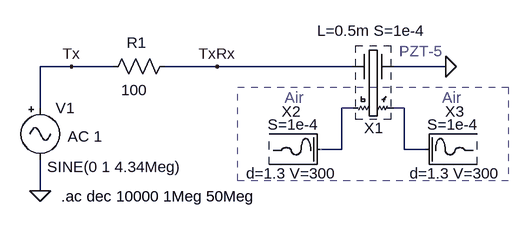
[diagram p0: schematic TestRezonatorAir.asc]
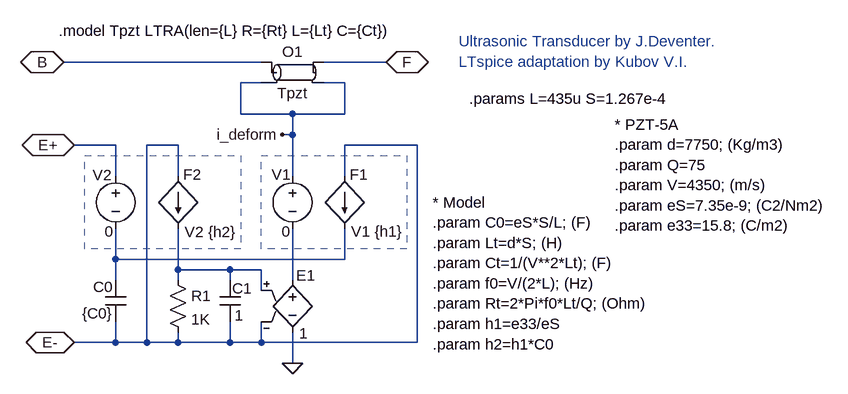
[diagram p1: sub-circuit piezoelement.asc]
TestRezonatorAir.asc, the LTspice schematic file:
Version 4
SHEET 1 880 680
WIRE -80 112 -128 112
WIRE -16 112 -80 112
WIRE 144 112 64 112
WIRE 352 112 144 112
WIRE 496 112 416 112
WIRE -128 176 -128 112
WIRE 352 176 336 176
WIRE 432 176 416 176
WIRE 336 240 336 176
WIRE 336 240 304 240
WIRE 432 240 432 176
WIRE 464 240 432 240
WIRE -128 304 -128 256
FLAG 496 112 0
FLAG -128 304 0
FLAG -80 112 Tx
FLAG 144 112 TxRx
SYMBOL PiezoElement 384 144 R0
WINDOW 0 1 63 Center 0
WINDOW 3 -2 -87 Center 0
SYMATTR InstName X1
SYMATTR Value L=0.5m S=1e-4
SYMBOL SubstInf 256 240 M0
WINDOW 0 -2 -59 Center 0
SYMATTR InstName X2
SYMATTR Value2 d=1.3 V=300
SYMBOL Misc\\signal -128 160 R0
WINDOW 3 11 107 Left 0
WINDOW 123 42 60 Left 0
WINDOW 39 0 0 Left 0
SYMATTR Value SINE(0 1 4.34Meg)
SYMATTR Value2 AC 1
SYMATTR InstName V1
SYMBOL res 80 96 R90
WINDOW 0 -5 60 VBottom 0
WINDOW 3 37 63 VTop 0
SYMATTR InstName R1
SYMATTR Value 100
SYMBOL SubstInf 512 240 R0
WINDOW 0 -2 -59 Center 0
SYMATTR InstName X3
SYMATTR Value2 d=1.3 V=300
TEXT 248 160 Left 0 ;Air
TEXT -96 312 Left 0 !.ac dec 10000 1Meg 50Meg
TEXT 424 88 Left 0 ;PZT-5
TEXT 520 160 Right 0 ;Air
RECTANGLE Normal 592 288 176 144 2

piezoelement.asc, the sub-circuit schematic file:
Version 4
SHEET 1 1424 680
WIRE 352 -96 48 -96
WIRE 544 -96 448 -96
WIRE 352 -64 320 -64
WIRE 480 -64 448 -64
WIRE 320 -16 320 -64
WIRE 400 -16 320 -16
WIRE 480 -16 480 -64
WIRE 480 -16 400 -16
WIRE 400 16 400 -16
WIRE 400 16 384 16
WIRE 128 32 64 32
WIRE 224 32 176 32
WIRE 592 32 480 32
WIRE 128 80 128 32
WIRE 224 80 224 32
WIRE 400 80 400 16
WIRE 480 80 480 32
WIRE 128 208 128 160
WIRE 480 208 480 160
WIRE 480 208 128 208
WIRE 224 224 224 160
WIRE 304 224 224 224
WIRE 352 224 304 224
WIRE 128 240 128 208
WIRE 224 240 224 224
WIRE 304 240 304 224
WIRE 400 240 400 160
WIRE 352 256 352 224
WIRE 128 336 128 304
WIRE 128 336 64 336
WIRE 176 336 176 32
WIRE 176 336 128 336
WIRE 224 336 224 320
WIRE 224 336 176 336
WIRE 304 336 304 304
WIRE 304 336 224 336
WIRE 352 336 352 304
WIRE 352 336 304 336
WIRE 592 336 592 32
WIRE 592 336 352 336
WIRE 400 368 400 320
FLAG 48 -96 B
IOPIN 48 -96 BiDir
FLAG 544 -96 F
IOPIN 544 -96 BiDir
FLAG 64 32 E+
IOPIN 64 32 BiDir
FLAG 64 336 E-
IOPIN 64 336 BiDir
FLAG 384 16 i_deform
FLAG 400 368 0
SYMBOL e 400 224 R0
WINDOW 0 6 9 Left 0
WINDOW 3 10 98 Left 0
SYMATTR InstName E1
SYMATTR Value 1
SYMBOL cap 112 240 R0
WINDOW 0 12 10 Right 0
WINDOW 3 12 51 Right 0
SYMATTR InstName C0
SYMATTR Value {C0}
SYMBOL res 208 224 R0
SYMATTR InstName R1
SYMATTR Value 1K
SYMBOL cap 288 240 R0
WINDOW 0 19 13 Left 0
WINDOW 3 23 54 Left 0
SYMATTR InstName C1
SYMATTR Value 1
SYMBOL ltline 400 -80 R0
SYMATTR InstName O1
SYMATTR Value Tpzt
SYMBOL f 224 80 R0
WINDOW 0 8 -3 Left 0
WINDOW 3 10 86 Left 0
SYMATTR InstName F2
SYMATTR Value V2 {h2}
SYMBOL voltage 128 64 R0
WINDOW 0 -6 14 Right 0
WINDOW 3 -3 101 Right 0
WINDOW 123 0 0 Left 0
WINDOW 39 0 0 Left 0
SYMATTR InstName V2
SYMATTR Value 0
SYMBOL voltage 400 64 R0
WINDOW 0 -3 13 Right 0
WINDOW 3 -3 101 Right 0
WINDOW 123 0 0 Left 0
WINDOW 39 0 0 Left 0
SYMATTR InstName V1
SYMATTR Value 0
SYMBOL f 480 80 R0
WINDOW 0 8 -3 Left 0
WINDOW 3 10 85 Left 0
SYMATTR InstName F1
SYMATTR Value V1 {h1}
TEXT 40 -144 Left 0 !.model Tpzt LTRA(len={L} R={Rt} L={Lt} C={Ct})
TEXT 896 0 Left 0 !* PZT-5A\n.param d=7750; (Kg/m3)\n.param Q=75\n.param V=4350; (m/s)\n.param eS=7.35e-9; (C2/Nm2)\n.param e33=15.8; (C/m2)
TEXT 656 -128 Left 0 ;Ultrasonic Transducer by J.Deventer. \nLTspice adaptation by Kubov V.I.
TEXT 616 120 Left 0 !* Model\n.param C0=eS*S/L; (F)\n.param Lt=d*S; (H) \n.param Ct=1/(V**2*Lt); (F)\n.param f0=V/(2*L); (Hz)\n.param Rt=2*Pi*f0*Lt/Q; (Ohm)\n.param h1=e33/eS \n.param h2=h1*C0
TEXT 672 -40 Left 0 !.params L=435u S=1.267e-4
RECTANGLE Normal 320 192 80 48 2
RECTANGLE Normal 576 192 352 48 2

The netlist it stands for:
* TestRezonatorAir.asc
XX1 TxRx 0 N001 N002 piezoelement params: L=0.5m S=1e-4
XX2 N001 SubstInf params: S=1e-4 d=1.3 V=300  ; pins b
V1 Tx 0 SINE(0 1 4.34Meg) AC 1
R1 TxRx Tx 100
XX3 N002 SubstInf params: S=1e-4 d=1.3 V=300  ; pins b

* block symbol definitions
.subckt piezoelement E+ E- B F
E1 N003 0 N002 E- 1
C0 N001 E- {C0}
R1 N002 E- 1K
C1 N002 E- 1
O1 B i_deform F i_deform Tpzt
F2 E- N002 V2 {h2}
V2 E+ N001 0
V1 i_deform N003 0
F1 E- N001 V1 {h1}
.model Tpzt LTRA(len={L} R={Rt} L={Lt} C={Ct})
* PZT-5A
.param d=7750; (Kg/m3)
.param Q=75
.param V=4350; (m/s)
.param eS=7.35e-9; (C2/Nm2)
.param e33=15.8; (C/m2)
* Ultrasonic Transducer by J.Deventer.
* LTspice adaptation by Kubov V.I.
* Model
.param C0=eS*S/L; (F)
.param Lt=d*S; (H)
.param Ct=1/(V**2*Lt); (F)
.param f0=V/(2*L); (Hz)
.param Rt=2*Pi*f0*Lt/Q; (Ohm)
.param h1=e33/eS
.param h2=h1*C0
.params L=435u S=1.267e-4
.ends piezoelement

* Air
.ac dec 10000 1Meg 50Meg
* PZT-5
* Air
.backanno
.end